# Altium project PCB_Project.PrjPcb
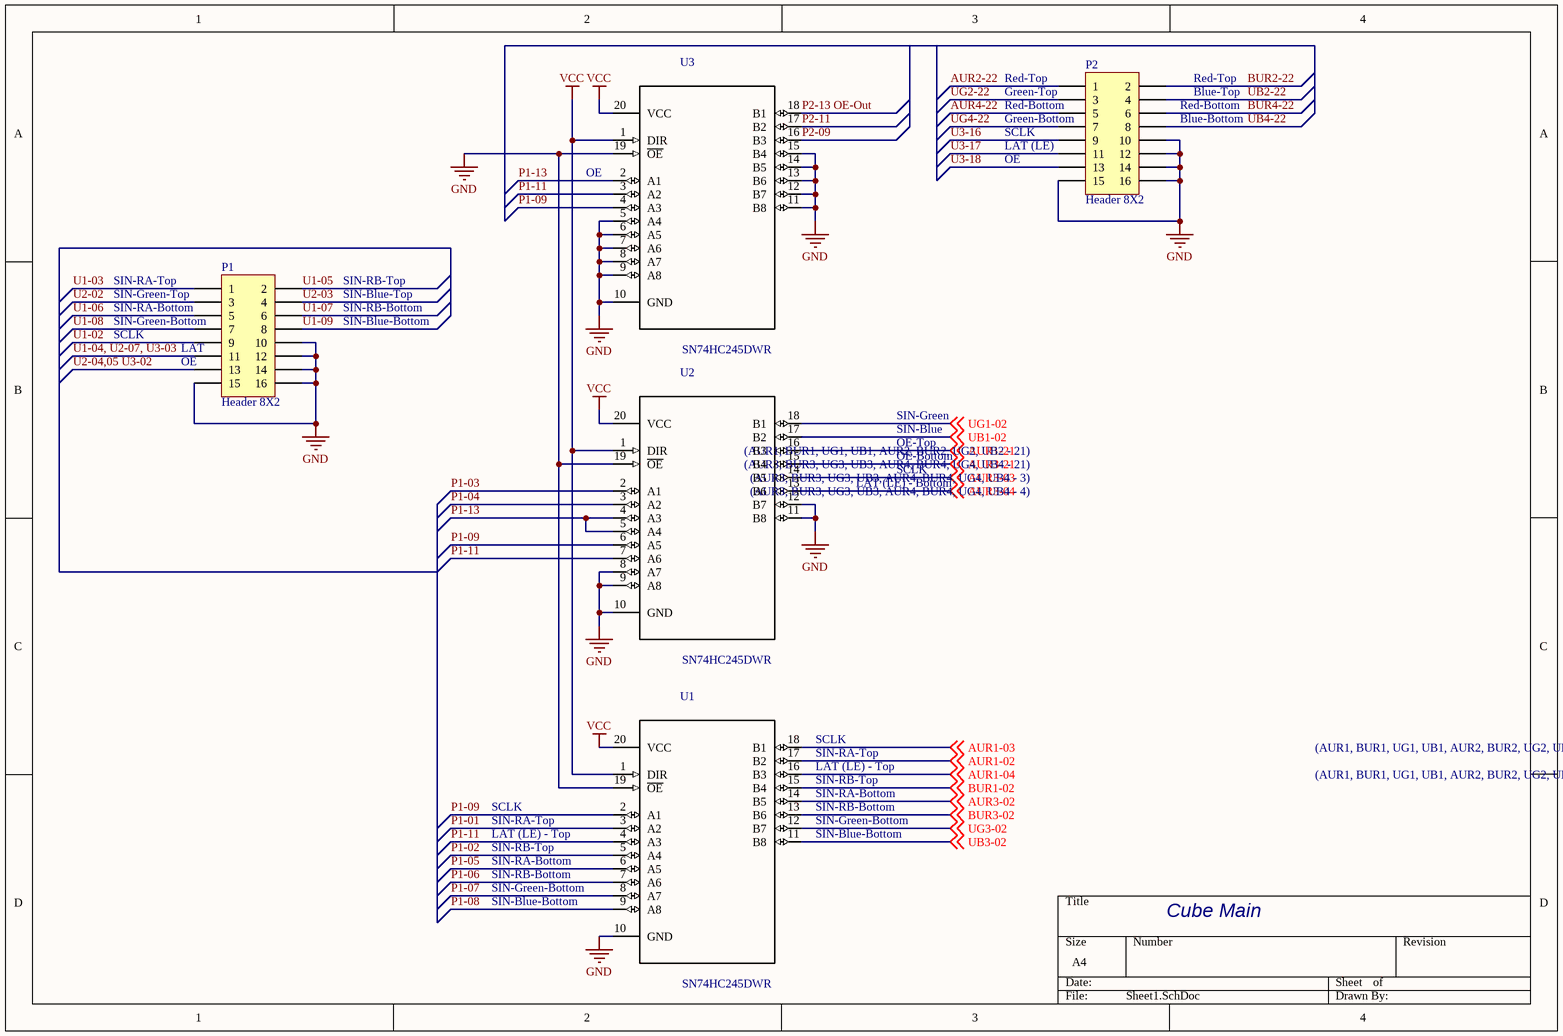
[diagram p0: Sheet1.SchDoc]
6 sheets, 293 parts. Net scope: global (net labels, ports and power ports of the same name join across sheets).
Sheets:
  Sheet1.SchDoc
  Sheet2.SchDoc
  Sheet3.SchDoc
  Sheet4.SchDoc
  Sheet5.SchDoc
  Sheet6.SchDoc

## Sheet Sheet1.SchDoc
size A4

### Parts
P1  Header 8X2  [HDR2X8]
P2  Header 8X2  [HDR2X8]
U1  SN74HC245DWR  [SOIC127P1030X265-20N]
U2  SN74HC245DWR  [SOIC127P1030X265-20N]
U3  SN74HC245DWR  [SOIC127P1030X265-20N]

### Nets
GND: P1.10 P1.12 P1.14 P1.15 P1.16 P2.10 P2.12 P2.14 P2.15 P2.16 U1.10(GND) U1.19(~{OE}) U2.8(A7) U2.9(A8) U2.10(GND) U2.11(B8) U2.12(B7) U2.19(~{OE}) U3.5(A4) U3.6(A5) U3.7(A6) U3.8(A7) U3.9(A8) U3.10(GND) U3.11(B8) U3.12(B7) U3.13(B6) U3.14(B5) U3.15(B4) U3.19(~{OE})
VCC: U1.1(DIR) U1.20(VCC) U2.1(DIR) U2.20(VCC) U3.1(DIR) U3.20(VCC)
AUR1-02: U1.17(B2) ; off-sheet AUR1-02
AUR1-03: U1.18(B1) ; off-sheet AUR1-03
AUR1-04: U1.16(B3) ; off-sheet AUR1-04
AUR1-21: U2.16(B3) ; off-sheet AUR1-21
AUR2-22: P2.1
AUR3-02: U1.14(B5) ; off-sheet AUR3-02
AUR3-03: U2.14(B5) ; off-sheet AUR3-03
AUR3-04: U2.13(B6) ; off-sheet AUR3-04
AUR3-21: U2.15(B4) ; off-sheet AUR3-21
AUR4-22: P2.5
BUR1-02: U1.15(B4) ; off-sheet BUR1-02
BUR2-22: P2.2
BUR3-02: U1.13(B6) ; off-sheet BUR3-02
BUR4-22: P2.6
P1-01: U1.3(A2)
P1-02: U1.5(A4)
P1-03: U2.2(A1)
P1-04: U2.3(A2)
P1-05: U1.6(A5)
P1-06: U1.7(A6)
P1-07: U1.8(A7)
P1-08: U1.9(A8)
P1-09: U1.2(A1) U2.6(A5) U3.4(A3)
P1-11: U1.4(A3) U2.7(A6) U3.3(A2)
P1-13: U2.4(A3) U2.5(A4) U3.2(A1)
P2-09: U3.16(B3)
P2-11: U3.17(B2)
P2-13 OE-Out: U3.18(B1)
U1-02: P1.9
U1-03: P1.1
U1-04, U2-07, U3-03: P1.11
U1-05: P1.2
U1-06: P1.5
U1-07: P1.6
U1-08: P1.7
U1-09: P1.8
U2-02: P1.3
U2-03: P1.4
U2-04,05 U3-02: P1.13
U3-16: P2.9
U3-17: P2.11
U3-18: P2.13
UB1-02: U2.17(B2) ; off-sheet UB1-02
UB2-22: P2.4
UB3-02: U1.11(B8) ; off-sheet UB3-02
UB4-22: P2.8
UG1-02: U2.18(B1) ; off-sheet UG1-02
UG2-22: P2.3
UG3-02: U1.12(B7) ; off-sheet UG3-02
UG4-22: P2.7

### Notes on the sheet
- (near P2) Red-Top
- (near P2) Green-Top
- (near P2) Red-Bottom
- Red-Top
- Blue-Top
- (near U3) OE
- (near P2) Green-Bottom
- SCLK
- (near P2) LAT (LE)
- OE
- (near P2) Blue-Bottom
- (near P1) SIN-RA-Top
- (near P1) SIN-Green-Top
- (near P1) SIN-RA-Bottom
- SIN-RB-Top
- SIN-Blue-Top
- SIN-RB-Bottom
- (near P1) SIN-Green-Bottom
- (near P1) LAT
- (near P1) OE
- SIN-Blue-Bottom
- SIN-Green
- SIN-Blue
- OE-Top
- (AUR1, BUR1, UG1, UB1, AUR2, BUR2, UG2, UB2 - 21)
- LAT (LE) - Bottom
- OE-Bottom
- (AUR3, BUR3, UG3, UB3, AUR4, BUR4, UG4, UB4 - 3)
- (AUR3, BUR3, UG3, UB3, AUR4, BUR4, UG4, UB4 - 21)
- (AUR3, BUR3, UG3, UB3, AUR4, BUR4, UG4, UB4 - 4)
- (near U1) LAT (LE) - Top
- (near U1) SCLK
- (near U1) SIN-RA-Top
- (near U1) SIN-RB-Top
- (AUR1, BUR1, UG1, UB1, AUR2, BUR2, UG2, UB2 - 3)
- (AUR1, BUR1, UG1, UB1, AUR2, BUR2, UG2, UB2 - 4)
- LAT (LE) - Top
- SIN-RA-Top
- (near U1) SIN-RA-Bottom
- (near U1) SIN-RB-Bottom
- (near U1) SIN-Green-Bottom
- (near U1) SIN-Blue-Bottom
- SIN-RA-Bottom
- Cube Main

### Library data of the parts
P1 P2 = Header 8X2: Header, 8-Pin, Dual row; LatestRevisionDate: 17-Jul-2002; LatestRevisionNote: Re-released for DXP Platform.; Publisher: Altium Limited
U1-U3 = SN74HC245DWR: Logic IC - Receiver, transceiver Texas Instruments SN74HC245DWR SOIC 20; MF: Texas Instruments; Price: 0.25 USD; Availability: Good; SnapEDA_Link: https://www.snapeda.com/parts/SN74HC245DWR/Texas%20Instruments/view-part/?ref=snap; MP: SN74HC245DWR; Package: SOIC-20 Texas Instruments; Value: *

## Sheet Sheet2.SchDoc
size A4
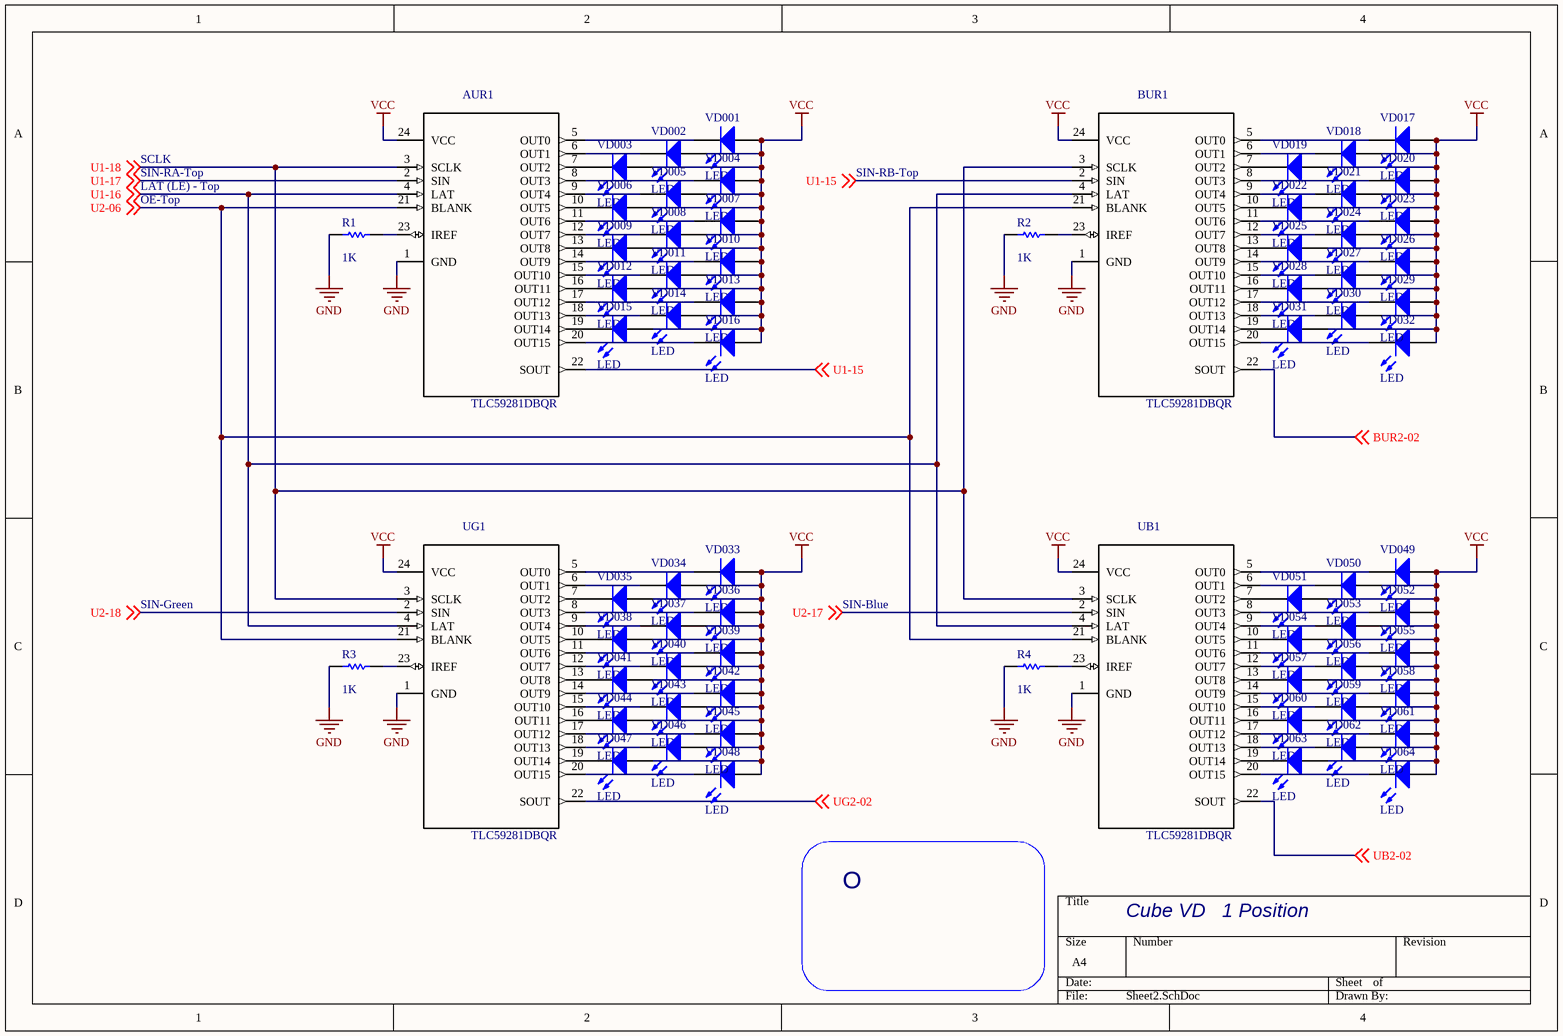
[diagram p1: Sheet2.SchDoc]

### Parts
AUR1  TLC59281DBQR  [SOP63P600X175-28N]
BUR1  TLC59281DBQR  [SOP63P600X175-28N]
R1  value 1K  [AXIAL-0.3]  (hidden comment: Res1)
R2  value 1K  [AXIAL-0.3]  (hidden comment: Res1)
R3  value 1K  [AXIAL-0.3]  (hidden comment: Res1)
R4  value 1K  [AXIAL-0.3]  (hidden comment: Res1)
UB1  TLC59281DBQR  [SOP63P600X175-28N]
UG1  TLC59281DBQR  [SOP63P600X175-28N]
VD001  LED  [LED-0]
VD002  LED  [LED-0]
VD003  LED  [LED-0]
VD004  LED  [LED-0]
VD005  LED  [LED-0]
VD006  LED  [LED-0]
VD007  LED  [LED-0]
VD008  LED  [LED-0]
VD009  LED  [LED-0]
VD010  LED  [LED-0]
VD011  LED  [LED-0]
VD012  LED  [LED-0]
VD013  LED  [LED-0]
VD014  LED  [LED-0]
VD015  LED  [LED-0]
VD016  LED  [LED-0]
VD017  LED  [LED-0]
VD018  LED  [LED-0]
VD019  LED  [LED-0]
VD020  LED  [LED-0]
VD021  LED  [LED-0]
VD022  LED  [LED-0]
VD023  LED  [LED-0]
VD024  LED  [LED-0]
VD025  LED  [LED-0]
VD026  LED  [LED-0]
VD027  LED  [LED-0]
VD028  LED  [LED-0]
VD029  LED  [LED-0]
VD030  LED  [LED-0]
VD031  LED  [LED-0]
VD032  LED  [LED-0]
VD033  LED  [LED-0]
VD034  LED  [LED-0]
VD035  LED  [LED-0]
VD036  LED  [LED-0]
VD037  LED  [LED-0]
VD038  LED  [LED-0]
VD039  LED  [LED-0]
VD040  LED  [LED-0]
VD041  LED  [LED-0]
VD042  LED  [LED-0]
VD043  LED  [LED-0]
VD044  LED  [LED-0]
VD045  LED  [LED-0]
VD046  LED  [LED-0]
VD047  LED  [LED-0]
VD048  LED  [LED-0]
VD049  LED  [LED-0]
VD050  LED  [LED-0]
VD051  LED  [LED-0]
VD052  LED  [LED-0]
VD053  LED  [LED-0]
VD054  LED  [LED-0]
VD055  LED  [LED-0]
VD056  LED  [LED-0]
VD057  LED  [LED-0]
VD058  LED  [LED-0]
VD059  LED  [LED-0]
VD060  LED  [LED-0]
VD061  LED  [LED-0]
VD062  LED  [LED-0]
VD063  LED  [LED-0]
VD064  LED  [LED-0]

### Nets
GND: AUR1.1(GND) BUR1.1(GND) R1.1 R2.1 R3.1 R4.1 UB1.1(GND) UG1.1(GND)
VCC: AUR1.24(VCC) BUR1.24(VCC) UB1.24(VCC) UG1.24(VCC) VD001.1(A) VD002.1(A) VD003.1(A) VD004.1(A) VD005.1(A) VD006.1(A) VD007.1(A) VD008.1(A) VD009.1(A) VD010.1(A) VD011.1(A) VD012.1(A) VD013.1(A) VD014.1(A) VD015.1(A) VD016.1(A) VD017.1(A) VD018.1(A) VD019.1(A) VD020.1(A) VD021.1(A) VD022.1(A) VD023.1(A) VD024.1(A) VD025.1(A) VD026.1(A) VD027.1(A) VD028.1(A) VD029.1(A) VD030.1(A) VD031.1(A) VD032.1(A) VD033.1(A) VD034.1(A) VD035.1(A) VD036.1(A) VD037.1(A) VD038.1(A) VD039.1(A) VD040.1(A) VD041.1(A) VD042.1(A) VD043.1(A) VD044.1(A) VD045.1(A) VD046.1(A) VD047.1(A) VD048.1(A) VD049.1(A) VD050.1(A) VD051.1(A) VD052.1(A) VD053.1(A) VD054.1(A) VD055.1(A) VD056.1(A) VD057.1(A) VD058.1(A) VD059.1(A) VD060.1(A) VD061.1(A) VD062.1(A) VD063.1(A) VD064.1(A)
BUR2-02: BUR1.22(SOUT) ; off-sheet BUR2-02
U1-15: AUR1.22(SOUT) BUR1.2(SIN) ; off-sheet U1-15
U1-16: AUR1.4(LAT) BUR1.4(LAT) UB1.4(LAT) UG1.4(LAT) ; off-sheet U1-16
U1-17: AUR1.2(SIN) ; off-sheet U1-17
U1-18: AUR1.3(SCLK) BUR1.3(SCLK) UB1.3(SCLK) UG1.3(SCLK) ; off-sheet U1-18
U2-06: AUR1.21(BLANK) BUR1.21(BLANK) UB1.21(BLANK) UG1.21(BLANK) ; off-sheet U2-06
U2-17: UB1.2(SIN) ; off-sheet U2-17
U2-18: UG1.2(SIN) ; off-sheet U2-18
UB2-02: UB1.22(SOUT) ; off-sheet UB2-02
UG2-02: UG1.22(SOUT) ; off-sheet UG2-02
NetAUR1_5: AUR1.5(OUT0) VD001.2(K)
NetAUR1_6: AUR1.6(OUT1) VD002.2(K)
NetAUR1_7: AUR1.7(OUT2) VD003.2(K)
NetAUR1_8: AUR1.8(OUT3) VD004.2(K)
NetAUR1_9: AUR1.9(OUT4) VD005.2(K)
NetAUR1_10: AUR1.10(OUT5) VD006.2(K)
NetAUR1_11: AUR1.11(OUT6) VD007.2(K)
NetAUR1_12: AUR1.12(OUT7) VD008.2(K)
NetAUR1_13: AUR1.13(OUT8) VD009.2(K)
NetAUR1_14: AUR1.14(OUT9) VD010.2(K)
NetAUR1_15: AUR1.15(OUT10) VD011.2(K)
NetAUR1_16: AUR1.16(OUT11) VD012.2(K)
NetAUR1_17: AUR1.17(OUT12) VD013.2(K)
NetAUR1_18: AUR1.18(OUT13) VD014.2(K)
NetAUR1_19: AUR1.19(OUT14) VD015.2(K)
NetAUR1_20: AUR1.20(OUT15) VD016.2(K)
NetAUR1_23: AUR1.23(IREF) R1.2
NetBUR1_5: BUR1.5(OUT0) VD017.2(K)
NetBUR1_6: BUR1.6(OUT1) VD018.2(K)
NetBUR1_7: BUR1.7(OUT2) VD019.2(K)
NetBUR1_8: BUR1.8(OUT3) VD020.2(K)
NetBUR1_9: BUR1.9(OUT4) VD021.2(K)
NetBUR1_10: BUR1.10(OUT5) VD022.2(K)
NetBUR1_11: BUR1.11(OUT6) VD023.2(K)
NetBUR1_12: BUR1.12(OUT7) VD024.2(K)
NetBUR1_13: BUR1.13(OUT8) VD025.2(K)
NetBUR1_14: BUR1.14(OUT9) VD026.2(K)
NetBUR1_15: BUR1.15(OUT10) VD027.2(K)
NetBUR1_16: BUR1.16(OUT11) VD028.2(K)
NetBUR1_17: BUR1.17(OUT12) VD029.2(K)
NetBUR1_18: BUR1.18(OUT13) VD030.2(K)
NetBUR1_19: BUR1.19(OUT14) VD031.2(K)
NetBUR1_20: BUR1.20(OUT15) VD032.2(K)
NetBUR1_23: BUR1.23(IREF) R2.2
NetR3_2: R3.2 UG1.23(IREF)
NetR4_2: R4.2 UB1.23(IREF)
NetUB1_5: UB1.5(OUT0) VD049.2(K)
NetUB1_6: UB1.6(OUT1) VD050.2(K)
NetUB1_7: UB1.7(OUT2) VD051.2(K)
NetUB1_8: UB1.8(OUT3) VD052.2(K)
NetUB1_9: UB1.9(OUT4) VD053.2(K)
NetUB1_10: UB1.10(OUT5) VD054.2(K)
NetUB1_11: UB1.11(OUT6) VD055.2(K)
NetUB1_12: UB1.12(OUT7) VD056.2(K)
NetUB1_13: UB1.13(OUT8) VD057.2(K)
NetUB1_14: UB1.14(OUT9) VD058.2(K)
NetUB1_15: UB1.15(OUT10) VD059.2(K)
NetUB1_16: UB1.16(OUT11) VD060.2(K)
NetUB1_17: UB1.17(OUT12) VD061.2(K)
NetUB1_18: UB1.18(OUT13) VD062.2(K)
NetUB1_19: UB1.19(OUT14) VD063.2(K)
NetUB1_20: UB1.20(OUT15) VD064.2(K)
NetUG1_5: UG1.5(OUT0) VD033.2(K)
NetUG1_6: UG1.6(OUT1) VD034.2(K)
NetUG1_7: UG1.7(OUT2) VD035.2(K)
NetUG1_8: UG1.8(OUT3) VD036.2(K)
NetUG1_9: UG1.9(OUT4) VD037.2(K)
NetUG1_10: UG1.10(OUT5) VD038.2(K)
NetUG1_11: UG1.11(OUT6) VD039.2(K)
NetUG1_12: UG1.12(OUT7) VD040.2(K)
NetUG1_13: UG1.13(OUT8) VD041.2(K)
NetUG1_14: UG1.14(OUT9) VD042.2(K)
NetUG1_15: UG1.15(OUT10) VD043.2(K)
NetUG1_16: UG1.16(OUT11) VD044.2(K)
NetUG1_17: UG1.17(OUT12) VD045.2(K)
NetUG1_18: UG1.18(OUT13) VD046.2(K)
NetUG1_19: UG1.19(OUT14) VD047.2(K)
NetUG1_20: UG1.20(OUT15) VD048.2(K)

### Notes on the sheet
- SCLK
- SIN-RA-Top
- SIN-RB-Top
- OE-Top
- LAT (LE) - Top
- SIN-Green
- SIN-Blue
- O
- Cube VD   1 Position

### Library data of the parts
AUR1 BUR1 UB1 UG1 = TLC59281DBQR: 16-Channel, Constant-Current LED Driver without LED Open Detection 24-SSOP -40 to 85; MF: Texas Instruments; Price: 0.74 USD; Availability: Good; SnapEDA_Link: https://www.snapeda.com/parts/TLC59281DBQR/Texas%20Instruments/view-part/?ref=snap; MP: TLC59281DBQR; Package: SSOP-24 Texas Instruments; Value: *
R1-R4 = Res1: Resistor; Published: 8-Jun-2000; LatestRevisionDate: 17-Jul-2002; LatestRevisionNote: Re-released for DXP Platform.; PackageReference: AXIAL-0.3; Publisher: Altium Limited; PackageDescription: Axial Device, Thru-Hole; 2 Leads; 0.3 in Pin Spacing
VD001 VD002 VD003 VD004 VD005 VD006 VD007 VD008 VD009 VD010 VD011 VD012 VD013 VD014 VD015 VD016 VD017 VD018 VD019 VD020 VD021 VD022 VD023 VD024 VD025 VD026 VD027 VD028 VD029 VD030 VD031 VD032 VD033 VD034 VD035 VD036 VD037 VD038 VD039 VD040 VD041 VD042 VD043 VD044 VD045 VD046 VD047 VD048 VD049 VD050 VD051 VD052 VD053 VD054 VD055 VD056 VD057 VD058 VD059 VD060 VD061 VD062 VD063 VD064 = LED0: Typical INFRARED GaAs LED; Published: 8-Jun-2000; LatestRevisionDate: 08-Jul-2005; LatestRevisionNote: Mech Layer 1 removed.; PackageReference: LED-0; Publisher: Altium Limited; PackageDescription: LED; 2 Leads

## Sheet Sheet3.SchDoc
size A4
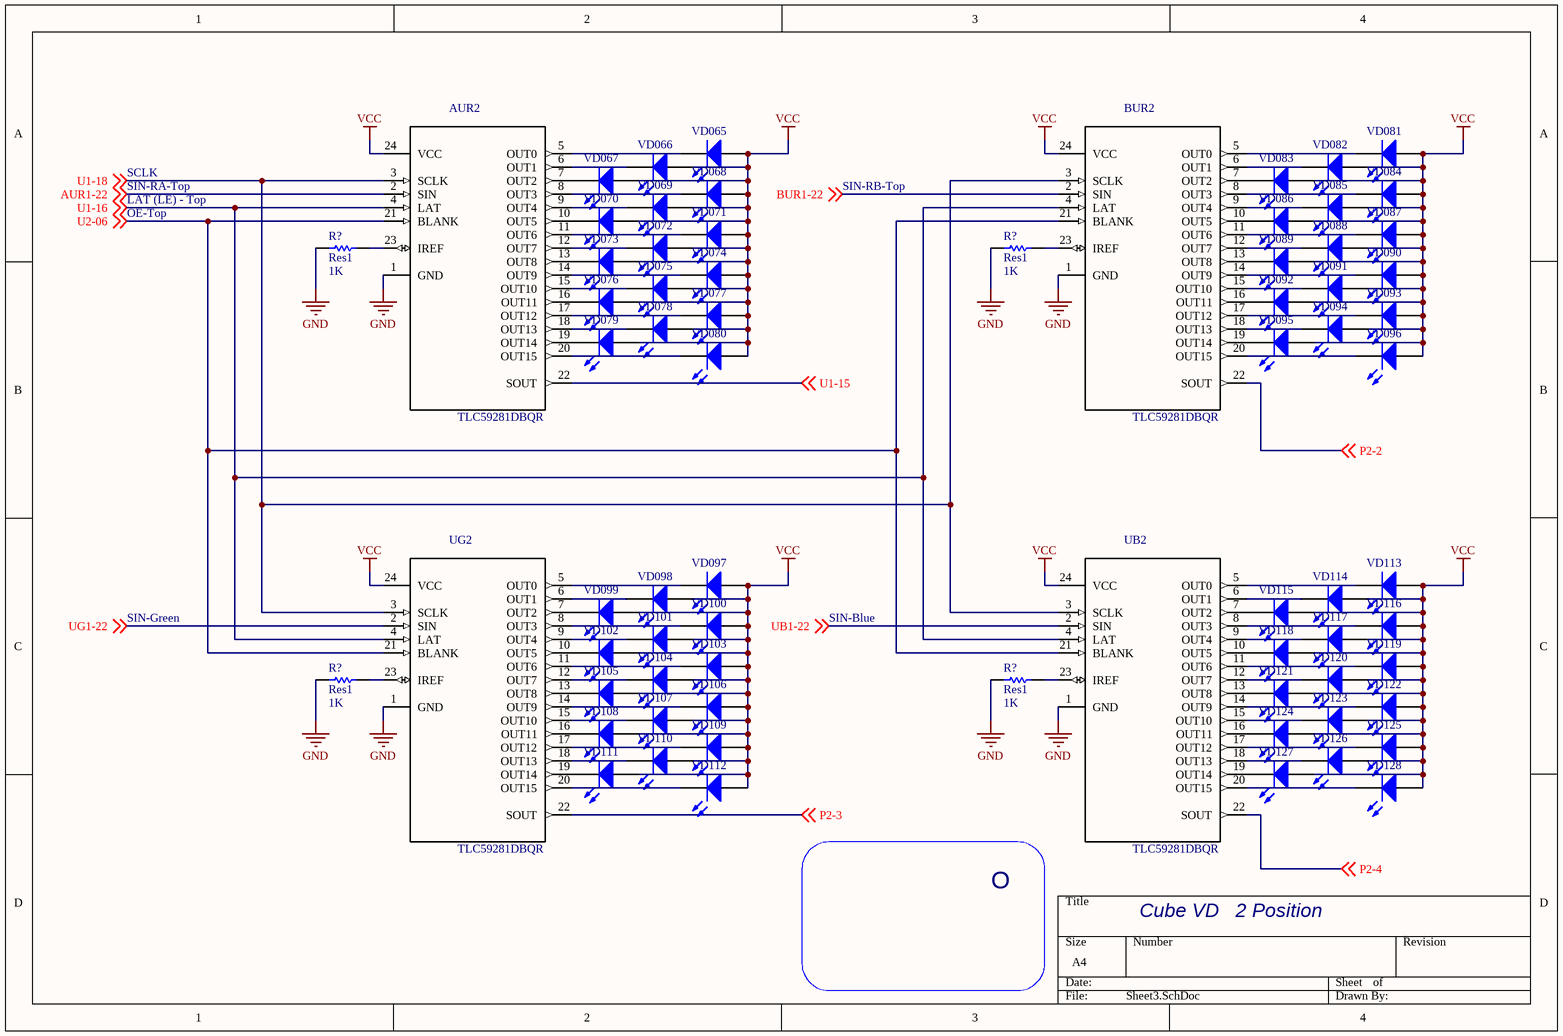
[diagram p2: Sheet3.SchDoc]

### Parts
(Parts that share a designator on the sheet are numbered #1, #2 ... from top to bottom, then left to right.)
AUR2  TLC59281DBQR  [SOP63P600X175-28N]
BUR2  TLC59281DBQR  [SOP63P600X175-28N]
R?#1  Res1  value 1K  [AXIAL-0.3]
R?#2  Res1  value 1K  [AXIAL-0.3]
R?#3  Res1  value 1K  [AXIAL-0.3]
R?#4  Res1  value 1K  [AXIAL-0.3]
UB2  TLC59281DBQR  [SOP63P600X175-28N]
UG2  TLC59281DBQR  [SOP63P600X175-28N]
VD065  LED  [LED-0]  (value not drawn)
VD066  LED  [LED-0]  (value not drawn)
VD067  LED  [LED-0]  (value not drawn)
VD068  LED  [LED-0]  (value not drawn)
VD069  LED  [LED-0]  (value not drawn)
VD070  LED  [LED-0]  (value not drawn)
VD071  LED  [LED-0]  (value not drawn)
VD072  (no value)  [LED-0]
VD073  LED  [LED-0]  (value not drawn)
VD074  (no value)  [LED-0]
VD075  LED  [LED-0]  (value not drawn)
VD076  LED  [LED-0]  (value not drawn)
VD077  LED  [LED-0]  (value not drawn)
VD078  LED  [LED-0]  (value not drawn)
VD079  LED  [LED-0]  (value not drawn)
VD080  LED  [LED-0]  (value not drawn)
VD081  LED  [LED-0]  (value not drawn)
VD082  LED  [LED-0]  (value not drawn)
VD083  LED  [LED-0]  (value not drawn)
VD084  LED  [LED-0]  (value not drawn)
VD085  LED  [LED-0]  (value not drawn)
VD086  LED  [LED-0]  (value not drawn)
VD087  LED  [LED-0]  (value not drawn)
VD088  LED  [LED-0]  (value not drawn)
VD089  LED  [LED-0]  (value not drawn)
VD090  LED  [LED-0]  (value not drawn)
VD091  LED  [LED-0]  (value not drawn)
VD092  LED  [LED-0]  (value not drawn)
VD093  LED  [LED-0]  (value not drawn)
VD094  LED  [LED-0]  (value not drawn)
VD095  LED  [LED-0]  (value not drawn)
VD096  LED  [LED-0]  (value not drawn)
VD097  LED  [LED-0]  (value not drawn)
VD098  LED  [LED-0]  (value not drawn)
VD099  LED  [LED-0]  (value not drawn)
VD100  LED  [LED-0]  (value not drawn)
VD101  LED  [LED-0]  (value not drawn)
VD102  LED  [LED-0]  (value not drawn)
VD103  LED  [LED-0]  (value not drawn)
VD104  LED  [LED-0]  (value not drawn)
VD105  LED  [LED-0]  (value not drawn)
VD106  LED  [LED-0]  (value not drawn)
VD107  LED  [LED-0]  (value not drawn)
VD108  LED  [LED-0]  (value not drawn)
VD109  LED  [LED-0]  (value not drawn)
VD110  LED  [LED-0]  (value not drawn)
VD111  LED  [LED-0]  (value not drawn)
VD112  LED  [LED-0]  (value not drawn)
VD113  LED  [LED-0]  (value not drawn)
VD114  LED  [LED-0]  (value not drawn)
VD115  LED  [LED-0]  (value not drawn)
VD116  LED  [LED-0]  (value not drawn)
VD117  LED  [LED-0]  (value not drawn)
VD118  LED  [LED-0]  (value not drawn)
VD119  LED  [LED-0]  (value not drawn)
VD120  LED  [LED-0]  (value not drawn)
VD121  LED  [LED-0]  (value not drawn)
VD122  LED  [LED-0]  (value not drawn)
VD123  LED  [LED-0]  (value not drawn)
VD124  LED  [LED-0]  (value not drawn)
VD125  LED  [LED-0]  (value not drawn)
VD126  LED  [LED-0]  (value not drawn)
VD127  LED  [LED-0]  (value not drawn)
VD128  LED  [LED-0]  (value not drawn)

### Nets
GND: AUR2.1(GND) BUR2.1(GND) R?#1.1 R?#2.1 R?#3.1 R?#4.1 UB2.1(GND) UG2.1(GND)
VCC: AUR2.24(VCC) BUR2.24(VCC) UB2.24(VCC) UG2.24(VCC) VD065.1(A) VD066.1(A) VD067.1(A) VD068.1(A) VD069.1(A) VD070.1(A) VD071.1(A) VD072.1(A) VD073.1(A) VD074.1(A) VD075.1(A) VD076.1(A) VD077.1(A) VD078.1(A) VD079.1(A) VD080.1(A) VD081.1(A) VD082.1(A) VD083.1(A) VD084.1(A) VD085.1(A) VD086.1(A) VD087.1(A) VD088.1(A) VD089.1(A) VD090.1(A) VD091.1(A) VD092.1(A) VD093.1(A) VD094.1(A) VD095.1(A) VD096.1(A) VD097.1(A) VD098.1(A) VD099.1(A) VD100.1(A) VD101.1(A) VD102.1(A) VD103.1(A) VD104.1(A) VD105.1(A) VD106.1(A) VD107.1(A) VD108.1(A) VD109.1(A) VD110.1(A) VD111.1(A) VD112.1(A) VD113.1(A) VD114.1(A) VD115.1(A) VD116.1(A) VD117.1(A) VD118.1(A) VD119.1(A) VD120.1(A) VD121.1(A) VD122.1(A) VD123.1(A) VD124.1(A) VD125.1(A) VD126.1(A) VD127.1(A) VD128.1(A)
AUR1-22: AUR2.2(SIN) ; off-sheet AUR1-22
BUR1-22: BUR2.2(SIN) ; off-sheet BUR1-22
P2-2: BUR2.22(SOUT) ; off-sheet P2-2
P2-3: UG2.22(SOUT) ; off-sheet P2-3
P2-4: UB2.22(SOUT) ; off-sheet P2-4
U1-15: AUR2.22(SOUT) ; off-sheet U1-15
U1-16: AUR2.4(LAT) BUR2.4(LAT) UB2.4(LAT) UG2.4(LAT) ; off-sheet U1-16
U1-18: AUR2.3(SCLK) BUR2.3(SCLK) UB2.3(SCLK) UG2.3(SCLK) ; off-sheet U1-18
U2-06: AUR2.21(BLANK) BUR2.21(BLANK) UB2.21(BLANK) UG2.21(BLANK) ; off-sheet U2-06
UB1-22: UB2.2(SIN) ; off-sheet UB1-22
UG1-22: UG2.2(SIN) ; off-sheet UG1-22
NetAUR2_5: AUR2.5(OUT0) VD065.2(K)
NetAUR2_6: AUR2.6(OUT1) VD066.2(K)
NetAUR2_7: AUR2.7(OUT2) VD067.2(K)
NetAUR2_8: AUR2.8(OUT3) VD068.2(K)
NetAUR2_9: AUR2.9(OUT4) VD069.2(K)
NetAUR2_10: AUR2.10(OUT5) VD070.2(K)
NetAUR2_11: AUR2.11(OUT6) VD071.2(K)
NetAUR2_12: AUR2.12(OUT7) VD072.2(K)
NetAUR2_13: AUR2.13(OUT8) VD073.2(K)
NetAUR2_14: AUR2.14(OUT9) VD074.2(K)
NetAUR2_15: AUR2.15(OUT10) VD075.2(K)
NetAUR2_16: AUR2.16(OUT11) VD076.2(K)
NetAUR2_17: AUR2.17(OUT12) VD077.2(K)
NetAUR2_18: AUR2.18(OUT13) VD078.2(K)
NetAUR2_19: AUR2.19(OUT14) VD079.2(K)
NetAUR2_20: AUR2.20(OUT15) VD080.2(K)
NetAUR2_23: AUR2.23(IREF) R?#1.2
NetBUR2_5: BUR2.5(OUT0) VD081.2(K)
NetBUR2_6: BUR2.6(OUT1) VD082.2(K)
NetBUR2_7: BUR2.7(OUT2) VD083.2(K)
NetBUR2_8: BUR2.8(OUT3) VD084.2(K)
NetBUR2_9: BUR2.9(OUT4) VD085.2(K)
NetBUR2_10: BUR2.10(OUT5) VD086.2(K)
NetBUR2_11: BUR2.11(OUT6) VD087.2(K)
NetBUR2_12: BUR2.12(OUT7) VD088.2(K)
NetBUR2_13: BUR2.13(OUT8) VD089.2(K)
NetBUR2_14: BUR2.14(OUT9) VD090.2(K)
NetBUR2_15: BUR2.15(OUT10) VD091.2(K)
NetBUR2_16: BUR2.16(OUT11) VD092.2(K)
NetBUR2_17: BUR2.17(OUT12) VD093.2(K)
NetBUR2_18: BUR2.18(OUT13) VD094.2(K)
NetBUR2_19: BUR2.19(OUT14) VD095.2(K)
NetBUR2_20: BUR2.20(OUT15) VD096.2(K)
NetBUR2_23: BUR2.23(IREF) R?#2.2
NetR?#3_2: R?#3.2 UG2.23(IREF)
NetR?#4_2: R?#4.2 UB2.23(IREF)
NetUB2_5: UB2.5(OUT0) VD113.2(K)
NetUB2_6: UB2.6(OUT1) VD114.2(K)
NetUB2_7: UB2.7(OUT2) VD115.2(K)
NetUB2_8: UB2.8(OUT3) VD116.2(K)
NetUB2_9: UB2.9(OUT4) VD117.2(K)
NetUB2_10: UB2.10(OUT5) VD118.2(K)
NetUB2_11: UB2.11(OUT6) VD119.2(K)
NetUB2_12: UB2.12(OUT7) VD120.2(K)
NetUB2_13: UB2.13(OUT8) VD121.2(K)
NetUB2_14: UB2.14(OUT9) VD122.2(K)
NetUB2_15: UB2.15(OUT10) VD123.2(K)
NetUB2_16: UB2.16(OUT11) VD124.2(K)
NetUB2_17: UB2.17(OUT12) VD125.2(K)
NetUB2_18: UB2.18(OUT13) VD126.2(K)
NetUB2_19: UB2.19(OUT14) VD127.2(K)
NetUB2_20: UB2.20(OUT15) VD128.2(K)
NetUG2_5: UG2.5(OUT0) VD097.2(K)
NetUG2_6: UG2.6(OUT1) VD098.2(K)
NetUG2_7: UG2.7(OUT2) VD099.2(K)
NetUG2_8: UG2.8(OUT3) VD100.2(K)
NetUG2_9: UG2.9(OUT4) VD101.2(K)
NetUG2_10: UG2.10(OUT5) VD102.2(K)
NetUG2_11: UG2.11(OUT6) VD103.2(K)
NetUG2_12: UG2.12(OUT7) VD104.2(K)
NetUG2_13: UG2.13(OUT8) VD105.2(K)
NetUG2_14: UG2.14(OUT9) VD106.2(K)
NetUG2_15: UG2.15(OUT10) VD107.2(K)
NetUG2_16: UG2.16(OUT11) VD108.2(K)
NetUG2_17: UG2.17(OUT12) VD109.2(K)
NetUG2_18: UG2.18(OUT13) VD110.2(K)
NetUG2_19: UG2.19(OUT14) VD111.2(K)
NetUG2_20: UG2.20(OUT15) VD112.2(K)

### Notes on the sheet
- SCLK
- OE-Top
- SIN-RA-Top
- LAT (LE) - Top
- SIN-RB-Top
- SIN-Green
- SIN-Blue
- O
- Cube VD   2 Position

### Library data of the parts
AUR2 BUR2 UB2 UG2 = TLC59281DBQR: as AUR1 on sheet Sheet2; Price: 0.74 USD; Availability: Good; SnapEDA_Link: https://www.snapeda.com/parts/TLC59281DBQR/Texas%20Instruments/view-part/?ref=snap; MP: TLC59281DBQR; Package: SSOP-24 Texas Instruments; Value: *
R?#1-R?#4 = Res1: Resistor; Published: 8-Jun-2000; LatestRevisionDate: 17-Jul-2002; LatestRevisionNote: Re-released for DXP Platform.; PackageReference: AXIAL-0.3; Publisher: Altium Limited; PackageDescription: Axial Device, Thru-Hole; 2 Leads; 0.3 in Pin Spacing
VD065 VD066 VD067 VD068 VD069 VD070 VD071 VD072 VD073 VD074 VD075 VD076 VD077 VD078 VD079 VD080 VD081 VD082 VD083 VD084 VD085 VD086 VD087 VD088 VD089 VD090 VD091 VD092 VD093 VD094 VD095 VD096 VD097 VD098 VD099-VD128 = LED0: Typical INFRARED GaAs LED; Published: 8-Jun-2000; LatestRevisionDate: 08-Jul-2005; LatestRevisionNote: Mech Layer 1 removed.; PackageReference: LED-0; Publisher: Altium Limited; PackageDescription: LED; 2 Leads

## Sheet Sheet4.SchDoc
size A4
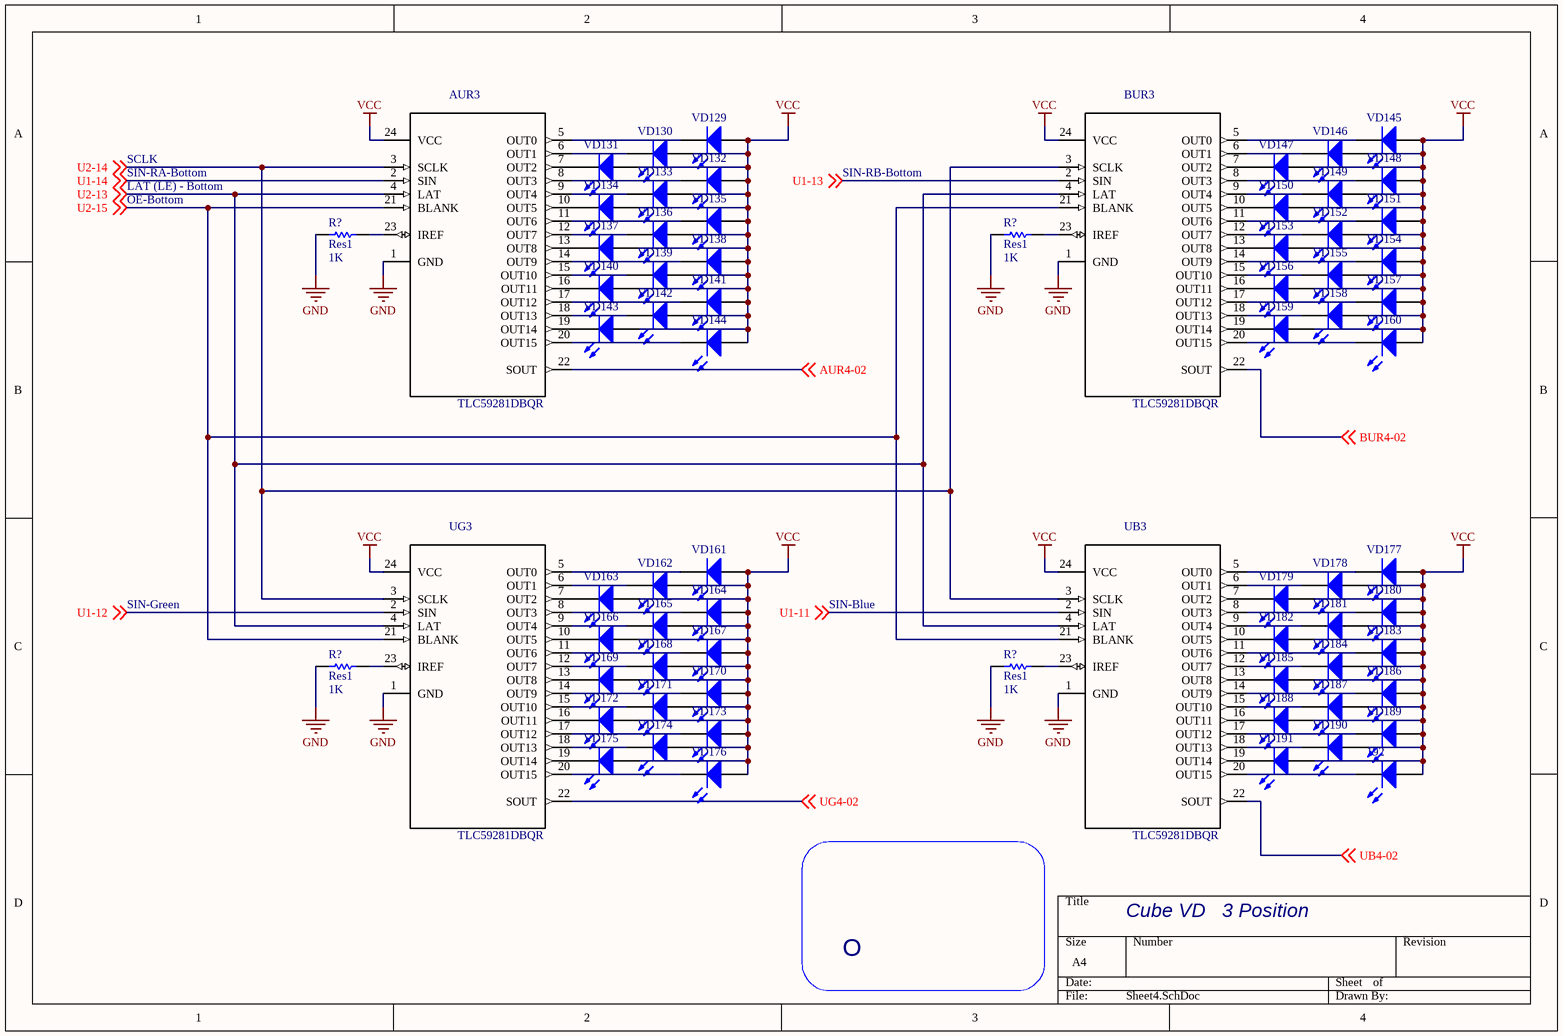
[diagram p3: Sheet4.SchDoc]

### Parts
(Parts that share a designator on the sheet are numbered #1, #2 ... from top to bottom, then left to right.)
192  LED  [LED-0]  (value not drawn)
AUR3  TLC59281DBQR  [SOP63P600X175-28N]
BUR3  TLC59281DBQR  [SOP63P600X175-28N]
R?#5  Res1  value 1K  [AXIAL-0.3]
R?#6  Res1  value 1K  [AXIAL-0.3]
R?#7  Res1  value 1K  [AXIAL-0.3]
R?#8  Res1  value 1K  [AXIAL-0.3]
UB3  TLC59281DBQR  [SOP63P600X175-28N]
UG3  TLC59281DBQR  [SOP63P600X175-28N]
VD129  LED  [LED-0]  (value not drawn)
VD130  LED  [LED-0]  (value not drawn)
VD131  LED  [LED-0]  (value not drawn)
VD132  LED  [LED-0]  (value not drawn)
VD133  LED  [LED-0]  (value not drawn)
VD134  LED  [LED-0]  (value not drawn)
VD135  LED  [LED-0]  (value not drawn)
VD136  (no value)  [LED-0]
VD137  LED  [LED-0]  (value not drawn)
VD138  (no value)  [LED-0]
VD139  LED  [LED-0]  (value not drawn)
VD140  LED  [LED-0]  (value not drawn)
VD141  LED  [LED-0]  (value not drawn)
VD142  LED  [LED-0]  (value not drawn)
VD143  LED  [LED-0]  (value not drawn)
VD144  LED  [LED-0]  (value not drawn)
VD145  LED  [LED-0]  (value not drawn)
VD146  LED  [LED-0]  (value not drawn)
VD147  LED  [LED-0]  (value not drawn)
VD148  LED  [LED-0]  (value not drawn)
VD149  LED  [LED-0]  (value not drawn)
VD150  LED  [LED-0]  (value not drawn)
VD151  LED  [LED-0]  (value not drawn)
VD152  LED  [LED-0]  (value not drawn)
VD153  LED  [LED-0]  (value not drawn)
VD154  LED  [LED-0]  (value not drawn)
VD155  LED  [LED-0]  (value not drawn)
VD156  LED  [LED-0]  (value not drawn)
VD157  LED  [LED-0]  (value not drawn)
VD158  LED  [LED-0]  (value not drawn)
VD159  LED  [LED-0]  (value not drawn)
VD160  LED  [LED-0]  (value not drawn)
VD161  LED  [LED-0]  (value not drawn)
VD162  LED  [LED-0]  (value not drawn)
VD163  LED  [LED-0]  (value not drawn)
VD164  LED  [LED-0]  (value not drawn)
VD165  LED  [LED-0]  (value not drawn)
VD166  LED  [LED-0]  (value not drawn)
VD167  LED  [LED-0]  (value not drawn)
VD168  LED  [LED-0]  (value not drawn)
VD169  LED  [LED-0]  (value not drawn)
VD170  LED  [LED-0]  (value not drawn)
VD171  LED  [LED-0]  (value not drawn)
VD172  LED  [LED-0]  (value not drawn)
VD173  LED  [LED-0]  (value not drawn)
VD174  LED  [LED-0]  (value not drawn)
VD175  LED  [LED-0]  (value not drawn)
VD176  LED  [LED-0]  (value not drawn)
VD177  LED  [LED-0]  (value not drawn)
VD178  LED  [LED-0]  (value not drawn)
VD179  LED  [LED-0]  (value not drawn)
VD180  LED  [LED-0]  (value not drawn)
VD181  LED  [LED-0]  (value not drawn)
VD182  LED  [LED-0]  (value not drawn)
VD183  LED  [LED-0]  (value not drawn)
VD184  LED  [LED-0]  (value not drawn)
VD185  LED  [LED-0]  (value not drawn)
VD186  LED  [LED-0]  (value not drawn)
VD187  LED  [LED-0]  (value not drawn)
VD188  LED  [LED-0]  (value not drawn)
VD189  LED  [LED-0]  (value not drawn)
VD190  LED  [LED-0]  (value not drawn)
VD191  LED  [LED-0]  (value not drawn)

### Nets
GND: AUR3.1(GND) BUR3.1(GND) R?#5.1 R?#6.1 R?#7.1 R?#8.1 UB3.1(GND) UG3.1(GND)
VCC: 192.1(A) AUR3.24(VCC) BUR3.24(VCC) UB3.24(VCC) UG3.24(VCC) VD129.1(A) VD130.1(A) VD131.1(A) VD132.1(A) VD133.1(A) VD134.1(A) VD135.1(A) VD136.1(A) VD137.1(A) VD138.1(A) VD139.1(A) VD140.1(A) VD141.1(A) VD142.1(A) VD143.1(A) VD144.1(A) VD145.1(A) VD146.1(A) VD147.1(A) VD148.1(A) VD149.1(A) VD150.1(A) VD151.1(A) VD152.1(A) VD153.1(A) VD154.1(A) VD155.1(A) VD156.1(A) VD157.1(A) VD158.1(A) VD159.1(A) VD160.1(A) VD161.1(A) VD162.1(A) VD163.1(A) VD164.1(A) VD165.1(A) VD166.1(A) VD167.1(A) VD168.1(A) VD169.1(A) VD170.1(A) VD171.1(A) VD172.1(A) VD173.1(A) VD174.1(A) VD175.1(A) VD176.1(A) VD177.1(A) VD178.1(A) VD179.1(A) VD180.1(A) VD181.1(A) VD182.1(A) VD183.1(A) VD184.1(A) VD185.1(A) VD186.1(A) VD187.1(A) VD188.1(A) VD189.1(A) VD190.1(A) VD191.1(A)
AUR4-02: AUR3.22(SOUT) ; off-sheet AUR4-02
BUR4-02: BUR3.22(SOUT) ; off-sheet BUR4-02
U1-11: UB3.2(SIN) ; off-sheet U1-11
U1-12: UG3.2(SIN) ; off-sheet U1-12
U1-13: BUR3.2(SIN) ; off-sheet U1-13
U1-14: AUR3.2(SIN) ; off-sheet U1-14
U2-13: AUR3.4(LAT) BUR3.4(LAT) UB3.4(LAT) UG3.4(LAT) ; off-sheet U2-13
U2-14: AUR3.3(SCLK) BUR3.3(SCLK) UB3.3(SCLK) UG3.3(SCLK) ; off-sheet U2-14
U2-15: AUR3.21(BLANK) BUR3.21(BLANK) UB3.21(BLANK) UG3.21(BLANK) ; off-sheet U2-15
UB4-02: UB3.22(SOUT) ; off-sheet UB4-02
UG4-02: UG3.22(SOUT) ; off-sheet UG4-02
Net192_2: 192.2(K) UB3.20(OUT15)
NetAUR3_5: AUR3.5(OUT0) VD129.2(K)
NetAUR3_6: AUR3.6(OUT1) VD130.2(K)
NetAUR3_7: AUR3.7(OUT2) VD131.2(K)
NetAUR3_8: AUR3.8(OUT3) VD132.2(K)
NetAUR3_9: AUR3.9(OUT4) VD133.2(K)
NetAUR3_10: AUR3.10(OUT5) VD134.2(K)
NetAUR3_11: AUR3.11(OUT6) VD135.2(K)
NetAUR3_12: AUR3.12(OUT7) VD136.2(K)
NetAUR3_13: AUR3.13(OUT8) VD137.2(K)
NetAUR3_14: AUR3.14(OUT9) VD138.2(K)
NetAUR3_15: AUR3.15(OUT10) VD139.2(K)
NetAUR3_16: AUR3.16(OUT11) VD140.2(K)
NetAUR3_17: AUR3.17(OUT12) VD141.2(K)
NetAUR3_18: AUR3.18(OUT13) VD142.2(K)
NetAUR3_19: AUR3.19(OUT14) VD143.2(K)
NetAUR3_20: AUR3.20(OUT15) VD144.2(K)
NetAUR3_23: AUR3.23(IREF) R?#5.2
NetBUR3_5: BUR3.5(OUT0) VD145.2(K)
NetBUR3_6: BUR3.6(OUT1) VD146.2(K)
NetBUR3_7: BUR3.7(OUT2) VD147.2(K)
NetBUR3_8: BUR3.8(OUT3) VD148.2(K)
NetBUR3_9: BUR3.9(OUT4) VD149.2(K)
NetBUR3_10: BUR3.10(OUT5) VD150.2(K)
NetBUR3_11: BUR3.11(OUT6) VD151.2(K)
NetBUR3_12: BUR3.12(OUT7) VD152.2(K)
NetBUR3_13: BUR3.13(OUT8) VD153.2(K)
NetBUR3_14: BUR3.14(OUT9) VD154.2(K)
NetBUR3_15: BUR3.15(OUT10) VD155.2(K)
NetBUR3_16: BUR3.16(OUT11) VD156.2(K)
NetBUR3_17: BUR3.17(OUT12) VD157.2(K)
NetBUR3_18: BUR3.18(OUT13) VD158.2(K)
NetBUR3_19: BUR3.19(OUT14) VD159.2(K)
NetBUR3_20: BUR3.20(OUT15) VD160.2(K)
NetBUR3_23: BUR3.23(IREF) R?#6.2
NetR?#7_2: R?#7.2 UG3.23(IREF)
NetR?#8_2: R?#8.2 UB3.23(IREF)
NetUB3_5: UB3.5(OUT0) VD177.2(K)
NetUB3_6: UB3.6(OUT1) VD178.2(K)
NetUB3_7: UB3.7(OUT2) VD179.2(K)
NetUB3_8: UB3.8(OUT3) VD180.2(K)
NetUB3_9: UB3.9(OUT4) VD181.2(K)
NetUB3_10: UB3.10(OUT5) VD182.2(K)
NetUB3_11: UB3.11(OUT6) VD183.2(K)
NetUB3_12: UB3.12(OUT7) VD184.2(K)
NetUB3_13: UB3.13(OUT8) VD185.2(K)
NetUB3_14: UB3.14(OUT9) VD186.2(K)
NetUB3_15: UB3.15(OUT10) VD187.2(K)
NetUB3_16: UB3.16(OUT11) VD188.2(K)
NetUB3_17: UB3.17(OUT12) VD189.2(K)
NetUB3_18: UB3.18(OUT13) VD190.2(K)
NetUB3_19: UB3.19(OUT14) VD191.2(K)
NetUG3_5: UG3.5(OUT0) VD161.2(K)
NetUG3_6: UG3.6(OUT1) VD162.2(K)
NetUG3_7: UG3.7(OUT2) VD163.2(K)
NetUG3_8: UG3.8(OUT3) VD164.2(K)
NetUG3_9: UG3.9(OUT4) VD165.2(K)
NetUG3_10: UG3.10(OUT5) VD166.2(K)
NetUG3_11: UG3.11(OUT6) VD167.2(K)
NetUG3_12: UG3.12(OUT7) VD168.2(K)
NetUG3_13: UG3.13(OUT8) VD169.2(K)
NetUG3_14: UG3.14(OUT9) VD170.2(K)
NetUG3_15: UG3.15(OUT10) VD171.2(K)
NetUG3_16: UG3.16(OUT11) VD172.2(K)
NetUG3_17: UG3.17(OUT12) VD173.2(K)
NetUG3_18: UG3.18(OUT13) VD174.2(K)
NetUG3_19: UG3.19(OUT14) VD175.2(K)
NetUG3_20: UG3.20(OUT15) VD176.2(K)

### Notes on the sheet
- SCLK
- SIN-RA-Bottom
- SIN-RB-Bottom
- OE-Bottom
- LAT (LE) - Bottom
- SIN-Green
- SIN-Blue
- Cube VD   3 Position
- O

### Library data of the parts
192 VD129-VD191 = LED0: Typical INFRARED GaAs LED; Published: 8-Jun-2000; LatestRevisionDate: 08-Jul-2005; LatestRevisionNote: Mech Layer 1 removed.; PackageReference: LED-0; Publisher: Altium Limited; PackageDescription: LED; 2 Leads
AUR3 BUR3 UB3 UG3 = TLC59281DBQR: as AUR1 on sheet Sheet2; Price: 0.74 USD; Availability: Good; SnapEDA_Link: https://www.snapeda.com/parts/TLC59281DBQR/Texas%20Instruments/view-part/?ref=snap; MP: TLC59281DBQR; Package: SSOP-24 Texas Instruments; Value: *
R?#5-R?#8 = Res1: Resistor; Published: 8-Jun-2000; LatestRevisionDate: 17-Jul-2002; LatestRevisionNote: Re-released for DXP Platform.; PackageReference: AXIAL-0.3; Publisher: Altium Limited; PackageDescription: Axial Device, Thru-Hole; 2 Leads; 0.3 in Pin Spacing

## Sheet Sheet5.SchDoc
size A4
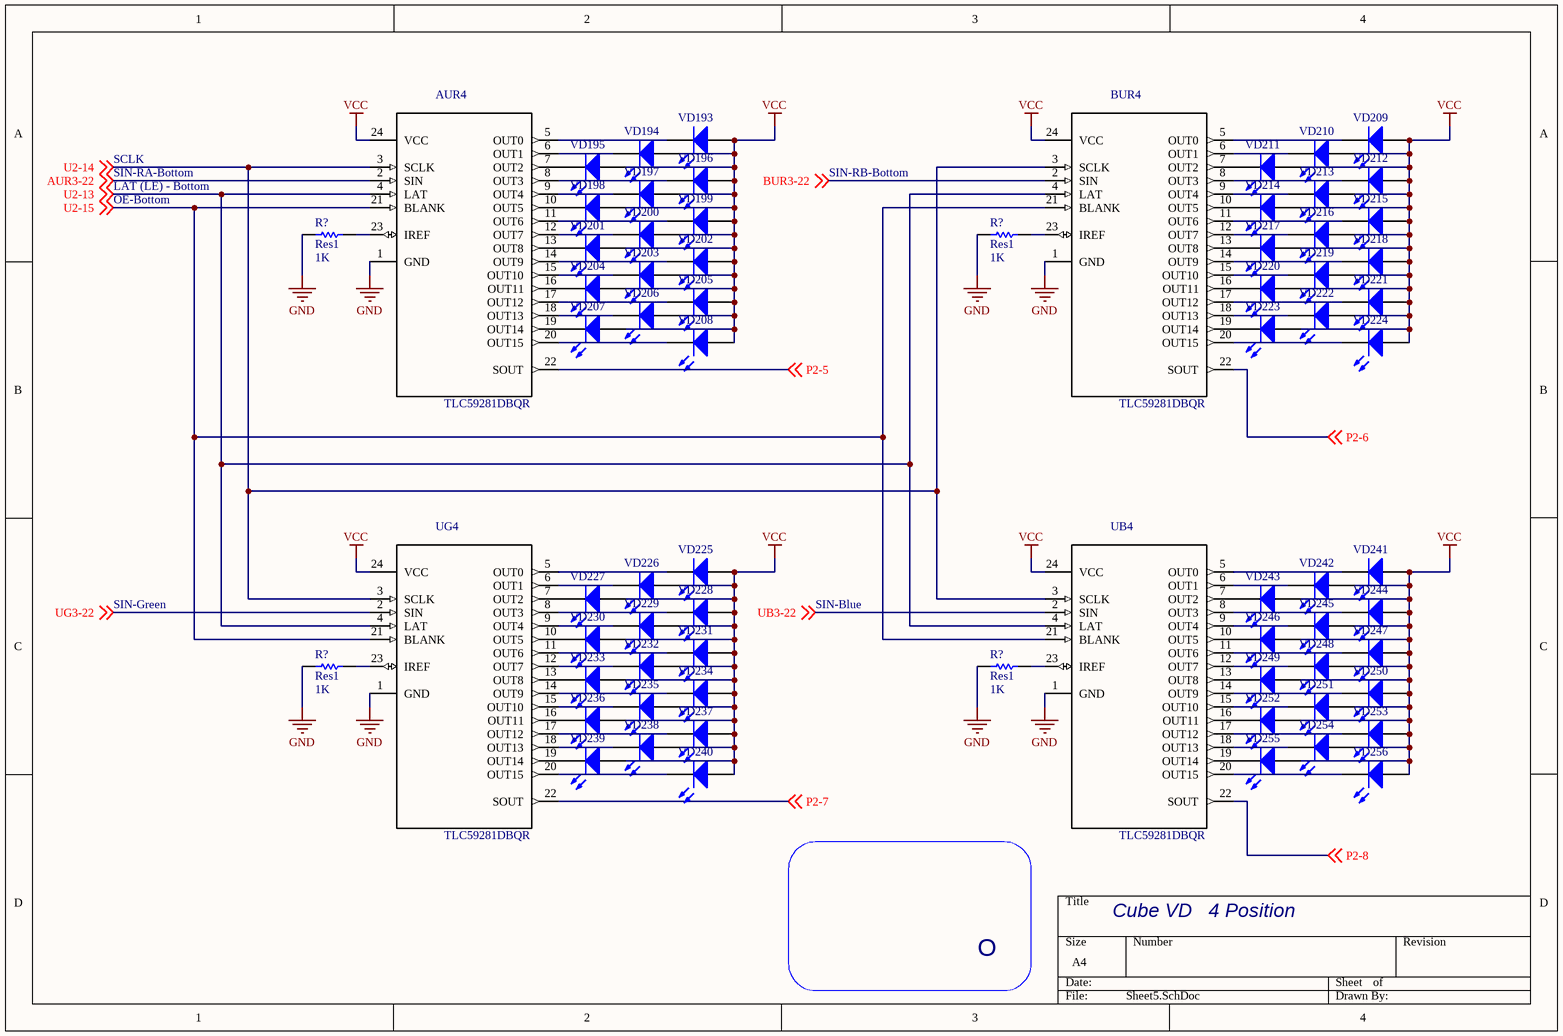
[diagram p4: Sheet5.SchDoc]

### Parts
(Parts that share a designator on the sheet are numbered #1, #2 ... from top to bottom, then left to right.)
AUR4  TLC59281DBQR  [SOP63P600X175-28N]
BUR4  TLC59281DBQR  [SOP63P600X175-28N]
R?#9  Res1  value 1K  [AXIAL-0.3]
R?#10  Res1  value 1K  [AXIAL-0.3]
R?#11  Res1  value 1K  [AXIAL-0.3]
R?#12  Res1  value 1K  [AXIAL-0.3]
UB4  TLC59281DBQR  [SOP63P600X175-28N]
UG4  TLC59281DBQR  [SOP63P600X175-28N]
VD193  LED  [LED-0]  (value not drawn)
VD194  LED  [LED-0]  (value not drawn)
VD195  LED  [LED-0]  (value not drawn)
VD196  LED  [LED-0]  (value not drawn)
VD197  LED  [LED-0]  (value not drawn)
VD198  LED  [LED-0]  (value not drawn)
VD199  LED  [LED-0]  (value not drawn)
VD200  (no value)  [LED-0]
VD201  LED  [LED-0]  (value not drawn)
VD202  (no value)  [LED-0]
VD203  LED  [LED-0]  (value not drawn)
VD204  LED  [LED-0]  (value not drawn)
VD205  LED  [LED-0]  (value not drawn)
VD206  LED  [LED-0]  (value not drawn)
VD207  LED  [LED-0]  (value not drawn)
VD208  LED  [LED-0]  (value not drawn)
VD209  LED  [LED-0]  (value not drawn)
VD210  LED  [LED-0]  (value not drawn)
VD211  LED  [LED-0]  (value not drawn)
VD212  LED  [LED-0]  (value not drawn)
VD213  LED  [LED-0]  (value not drawn)
VD214  LED  [LED-0]  (value not drawn)
VD215  LED  [LED-0]  (value not drawn)
VD216  LED  [LED-0]  (value not drawn)
VD217  LED  [LED-0]  (value not drawn)
VD218  LED  [LED-0]  (value not drawn)
VD219  LED  [LED-0]  (value not drawn)
VD220  LED  [LED-0]  (value not drawn)
VD221  LED  [LED-0]  (value not drawn)
VD222  LED  [LED-0]  (value not drawn)
VD223  LED  [LED-0]  (value not drawn)
VD224  LED  [LED-0]  (value not drawn)
VD225  LED  [LED-0]  (value not drawn)
VD226  LED  [LED-0]  (value not drawn)
VD227  LED  [LED-0]  (value not drawn)
VD228  LED  [LED-0]  (value not drawn)
VD229  LED  [LED-0]  (value not drawn)
VD230  LED  [LED-0]  (value not drawn)
VD231  LED  [LED-0]  (value not drawn)
VD232  LED  [LED-0]  (value not drawn)
VD233  LED  [LED-0]  (value not drawn)
VD234  LED  [LED-0]  (value not drawn)
VD235  LED  [LED-0]  (value not drawn)
VD236  LED  [LED-0]  (value not drawn)
VD237  LED  [LED-0]  (value not drawn)
VD238  LED  [LED-0]  (value not drawn)
VD239  LED  [LED-0]  (value not drawn)
VD240  LED  [LED-0]  (value not drawn)
VD241  LED  [LED-0]  (value not drawn)
VD242  LED  [LED-0]  (value not drawn)
VD243  LED  [LED-0]  (value not drawn)
VD244  LED  [LED-0]  (value not drawn)
VD245  LED  [LED-0]  (value not drawn)
VD246  LED  [LED-0]  (value not drawn)
VD247  LED  [LED-0]  (value not drawn)
VD248  LED  [LED-0]  (value not drawn)
VD249  LED  [LED-0]  (value not drawn)
VD250  LED  [LED-0]  (value not drawn)
VD251  LED  [LED-0]  (value not drawn)
VD252  LED  [LED-0]  (value not drawn)
VD253  LED  [LED-0]  (value not drawn)
VD254  LED  [LED-0]  (value not drawn)
VD255  LED  [LED-0]  (value not drawn)
VD256  LED  [LED-0]  (value not drawn)

### Nets
GND: AUR4.1(GND) BUR4.1(GND) R?#9.1 R?#10.1 R?#11.1 R?#12.1 UB4.1(GND) UG4.1(GND)
VCC: AUR4.24(VCC) BUR4.24(VCC) UB4.24(VCC) UG4.24(VCC) VD193.1(A) VD194.1(A) VD195.1(A) VD196.1(A) VD197.1(A) VD198.1(A) VD199.1(A) VD200.1(A) VD201.1(A) VD202.1(A) VD203.1(A) VD204.1(A) VD205.1(A) VD206.1(A) VD207.1(A) VD208.1(A) VD209.1(A) VD210.1(A) VD211.1(A) VD212.1(A) VD213.1(A) VD214.1(A) VD215.1(A) VD216.1(A) VD217.1(A) VD218.1(A) VD219.1(A) VD220.1(A) VD221.1(A) VD222.1(A) VD223.1(A) VD224.1(A) VD225.1(A) VD226.1(A) VD227.1(A) VD228.1(A) VD229.1(A) VD230.1(A) VD231.1(A) VD232.1(A) VD233.1(A) VD234.1(A) VD235.1(A) VD236.1(A) VD237.1(A) VD238.1(A) VD239.1(A) VD240.1(A) VD241.1(A) VD242.1(A) VD243.1(A) VD244.1(A) VD245.1(A) VD246.1(A) VD247.1(A) VD248.1(A) VD249.1(A) VD250.1(A) VD251.1(A) VD252.1(A) VD253.1(A) VD254.1(A) VD255.1(A) VD256.1(A)
AUR3-22: AUR4.2(SIN) ; off-sheet AUR3-22
BUR3-22: BUR4.2(SIN) ; off-sheet BUR3-22
P2-5: AUR4.22(SOUT) ; off-sheet P2-5
P2-6: BUR4.22(SOUT) ; off-sheet P2-6
P2-7: UG4.22(SOUT) ; off-sheet P2-7
P2-8: UB4.22(SOUT) ; off-sheet P2-8
U2-13: AUR4.4(LAT) BUR4.4(LAT) UB4.4(LAT) UG4.4(LAT) ; off-sheet U2-13
U2-14: AUR4.3(SCLK) BUR4.3(SCLK) UB4.3(SCLK) UG4.3(SCLK) ; off-sheet U2-14
U2-15: AUR4.21(BLANK) BUR4.21(BLANK) UB4.21(BLANK) UG4.21(BLANK) ; off-sheet U2-15
UB3-22: UB4.2(SIN) ; off-sheet UB3-22
UG3-22: UG4.2(SIN) ; off-sheet UG3-22
NetAUR4_5: AUR4.5(OUT0) VD193.2(K)
NetAUR4_6: AUR4.6(OUT1) VD194.2(K)
NetAUR4_7: AUR4.7(OUT2) VD195.2(K)
NetAUR4_8: AUR4.8(OUT3) VD196.2(K)
NetAUR4_9: AUR4.9(OUT4) VD197.2(K)
NetAUR4_10: AUR4.10(OUT5) VD198.2(K)
NetAUR4_11: AUR4.11(OUT6) VD199.2(K)
NetAUR4_12: AUR4.12(OUT7) VD200.2(K)
NetAUR4_13: AUR4.13(OUT8) VD201.2(K)
NetAUR4_14: AUR4.14(OUT9) VD202.2(K)
NetAUR4_15: AUR4.15(OUT10) VD203.2(K)
NetAUR4_16: AUR4.16(OUT11) VD204.2(K)
NetAUR4_17: AUR4.17(OUT12) VD205.2(K)
NetAUR4_18: AUR4.18(OUT13) VD206.2(K)
NetAUR4_19: AUR4.19(OUT14) VD207.2(K)
NetAUR4_20: AUR4.20(OUT15) VD208.2(K)
NetAUR4_23: AUR4.23(IREF) R?#9.2
NetBUR4_5: BUR4.5(OUT0) VD209.2(K)
NetBUR4_6: BUR4.6(OUT1) VD210.2(K)
NetBUR4_7: BUR4.7(OUT2) VD211.2(K)
NetBUR4_8: BUR4.8(OUT3) VD212.2(K)
NetBUR4_9: BUR4.9(OUT4) VD213.2(K)
NetBUR4_10: BUR4.10(OUT5) VD214.2(K)
NetBUR4_11: BUR4.11(OUT6) VD215.2(K)
NetBUR4_12: BUR4.12(OUT7) VD216.2(K)
NetBUR4_13: BUR4.13(OUT8) VD217.2(K)
NetBUR4_14: BUR4.14(OUT9) VD218.2(K)
NetBUR4_15: BUR4.15(OUT10) VD219.2(K)
NetBUR4_16: BUR4.16(OUT11) VD220.2(K)
NetBUR4_17: BUR4.17(OUT12) VD221.2(K)
NetBUR4_18: BUR4.18(OUT13) VD222.2(K)
NetBUR4_19: BUR4.19(OUT14) VD223.2(K)
NetBUR4_20: BUR4.20(OUT15) VD224.2(K)
NetBUR4_23: BUR4.23(IREF) R?#10.2
NetR?#11_2: R?#11.2 UG4.23(IREF)
NetR?#12_2: R?#12.2 UB4.23(IREF)
NetUB4_5: UB4.5(OUT0) VD241.2(K)
NetUB4_6: UB4.6(OUT1) VD242.2(K)
NetUB4_7: UB4.7(OUT2) VD243.2(K)
NetUB4_8: UB4.8(OUT3) VD244.2(K)
NetUB4_9: UB4.9(OUT4) VD245.2(K)
NetUB4_10: UB4.10(OUT5) VD246.2(K)
NetUB4_11: UB4.11(OUT6) VD247.2(K)
NetUB4_12: UB4.12(OUT7) VD248.2(K)
NetUB4_13: UB4.13(OUT8) VD249.2(K)
NetUB4_14: UB4.14(OUT9) VD250.2(K)
NetUB4_15: UB4.15(OUT10) VD251.2(K)
NetUB4_16: UB4.16(OUT11) VD252.2(K)
NetUB4_17: UB4.17(OUT12) VD253.2(K)
NetUB4_18: UB4.18(OUT13) VD254.2(K)
NetUB4_19: UB4.19(OUT14) VD255.2(K)
NetUB4_20: UB4.20(OUT15) VD256.2(K)
NetUG4_5: UG4.5(OUT0) VD225.2(K)
NetUG4_6: UG4.6(OUT1) VD226.2(K)
NetUG4_7: UG4.7(OUT2) VD227.2(K)
NetUG4_8: UG4.8(OUT3) VD228.2(K)
NetUG4_9: UG4.9(OUT4) VD229.2(K)
NetUG4_10: UG4.10(OUT5) VD230.2(K)
NetUG4_11: UG4.11(OUT6) VD231.2(K)
NetUG4_12: UG4.12(OUT7) VD232.2(K)
NetUG4_13: UG4.13(OUT8) VD233.2(K)
NetUG4_14: UG4.14(OUT9) VD234.2(K)
NetUG4_15: UG4.15(OUT10) VD235.2(K)
NetUG4_16: UG4.16(OUT11) VD236.2(K)
NetUG4_17: UG4.17(OUT12) VD237.2(K)
NetUG4_18: UG4.18(OUT13) VD238.2(K)
NetUG4_19: UG4.19(OUT14) VD239.2(K)
NetUG4_20: UG4.20(OUT15) VD240.2(K)

### Notes on the sheet
- SCLK
- SIN-RA-Bottom
- SIN-RB-Bottom
- OE-Bottom
- LAT (LE) - Bottom
- SIN-Green
- SIN-Blue
- Cube VD   4 Position
- O

### Library data of the parts
AUR4 BUR4 UB4 UG4 = TLC59281DBQR: as AUR1 on sheet Sheet2; Price: 0.74 USD; Availability: Good; SnapEDA_Link: https://www.snapeda.com/parts/TLC59281DBQR/Texas%20Instruments/view-part/?ref=snap; MP: TLC59281DBQR; Package: SSOP-24 Texas Instruments; Value: *
R?#9-R?#12 = Res1: Resistor; Published: 8-Jun-2000; LatestRevisionDate: 17-Jul-2002; LatestRevisionNote: Re-released for DXP Platform.; PackageReference: AXIAL-0.3; Publisher: Altium Limited; PackageDescription: Axial Device, Thru-Hole; 2 Leads; 0.3 in Pin Spacing
VD193-VD256 = LED0: Typical INFRARED GaAs LED; Published: 8-Jun-2000; LatestRevisionDate: 08-Jul-2005; LatestRevisionNote: Mech Layer 1 removed.; PackageReference: LED-0; Publisher: Altium Limited; PackageDescription: LED; 2 Leads

## Sheet Sheet6.SchDoc
size A4

## Nets that join several sheets
GND: Sheet1 (30 pins), Sheet2 (8 pins), Sheet3 (8 pins), Sheet4 (8 pins), Sheet5 (8 pins)
VCC: Sheet1 (6 pins), Sheet2 (68 pins), Sheet3 (68 pins), Sheet4 (68 pins), Sheet5 (68 pins)
U1-15: Sheet2 (AUR1.22 BUR1.2), Sheet3 (AUR2.22)
U1-16: Sheet2 (AUR1.4 BUR1.4 UB1.4 UG1.4), Sheet3 (AUR2.4 BUR2.4 UB2.4 UG2.4)
U1-18: Sheet2 (AUR1.3 BUR1.3 UB1.3 UG1.3), Sheet3 (AUR2.3 BUR2.3 UB2.3 UG2.3)
U2-06: Sheet2 (AUR1.21 BUR1.21 UB1.21 UG1.21), Sheet3 (AUR2.21 BUR2.21 UB2.21 UG2.21)
U2-13: Sheet4 (AUR3.4 BUR3.4 UB3.4 UG3.4), Sheet5 (AUR4.4 BUR4.4 UB4.4 UG4.4)
U2-14: Sheet4 (AUR3.3 BUR3.3 UB3.3 UG3.3), Sheet5 (AUR4.3 BUR4.3 UB4.3 UG4.3)
U2-15: Sheet4 (AUR3.21 BUR3.21 UB3.21 UG3.21), Sheet5 (AUR4.21 BUR4.21 UB4.21 UG4.21)